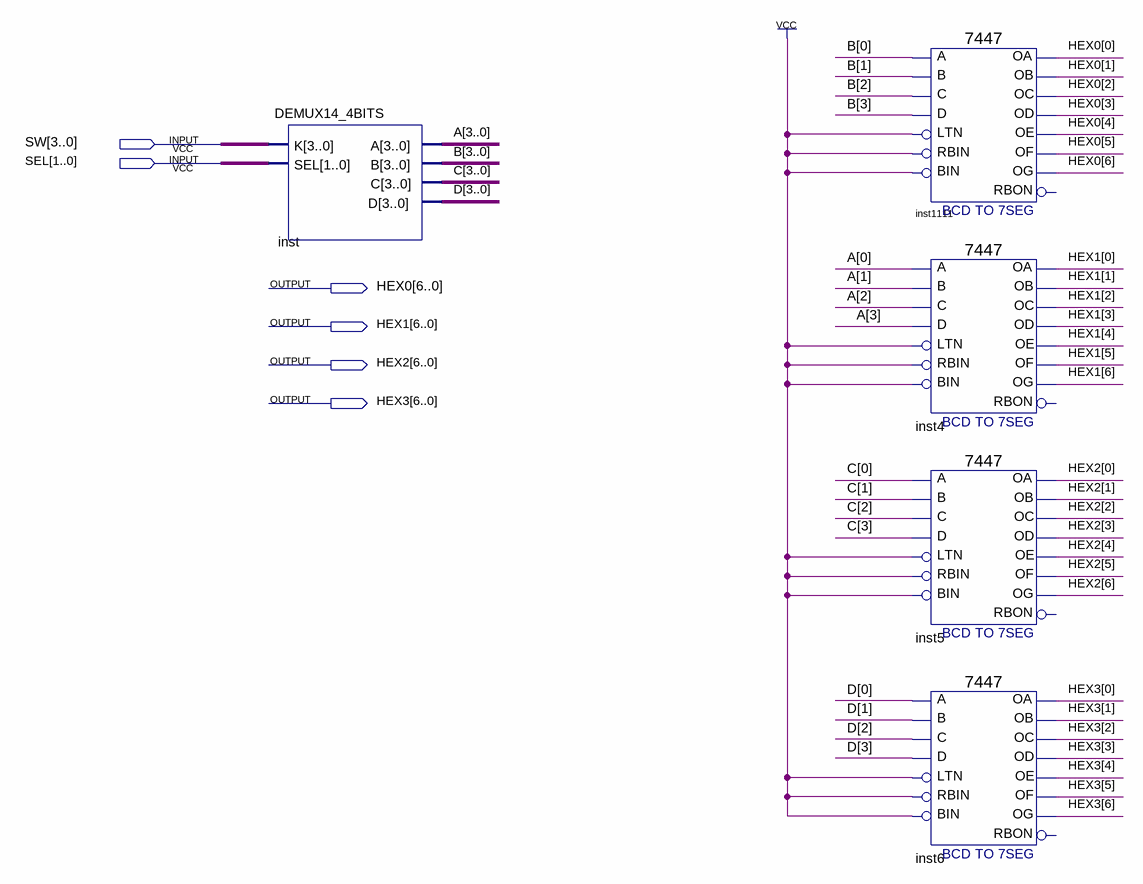
[diagram p0: schematic sheet]
// Quartus schematic TESTE_DEMUX14_4BITS.bdf as structural Verilog: 5 symbols, 6 pins
module TESTE_DEMUX14_4BITS (
  input  [3:0] SW,
  input  [1:0] SEL,
  output [6:0] HEX0,
  output [6:0] HEX1,
  output [6:0] HEX2,
  output [6:0] HEX3
);

  wire [3:0] A, B, C, D;

  DEMUX14_4BITS inst (.K(SW), .SEL(SEL), .A(A), .B(B), .C(C), .D(D));
  \7447  inst1111 (
    .LTN(1'b1), .B(B[1]), .C(B[2]), .D(B[3]), .RBIN(1'b1), .BIN(1'b1), .A(B[0]), .OB(HEX0[1]), .OC(HEX0[2]),
    .OE(HEX0[4]), .OD(HEX0[3]), .OF(HEX0[5]), .OG(HEX0[6]), .OA(HEX0[0]));  // open: RBON
  \7447  inst4 (
    .LTN(1'b1), .B(A[1]), .C(A[2]), .D(A[3]), .RBIN(1'b1), .BIN(1'b1), .A(A[0]), .OB(HEX1[1]), .OC(HEX1[2]),
    .OE(HEX1[4]), .OD(HEX1[3]), .OF(HEX1[5]), .OG(HEX1[6]), .OA(HEX1[0]));  // open: RBON
  \7447  inst5 (
    .LTN(1'b1), .B(C[1]), .C(C[2]), .D(C[3]), .RBIN(1'b1), .BIN(1'b1), .A(C[0]), .OB(HEX2[1]), .OC(HEX2[2]),
    .OE(HEX2[4]), .OD(HEX2[3]), .OF(HEX2[5]), .OG(HEX2[6]), .OA(HEX2[0]));  // open: RBON
  \7447  inst6 (
    .LTN(1'b1), .B(D[1]), .C(D[2]), .D(D[3]), .RBIN(1'b1), .BIN(1'b1), .A(D[0]), .OB(HEX3[1]), .OC(HEX3[2]),
    .OE(HEX3[4]), .OD(HEX3[3]), .OF(HEX3[5]), .OG(HEX3[6]), .OA(HEX3[0]));  // open: RBON
endmodule
